# Altium project DM3390_R0M0E0.PrjPcb (part 4 of 5)

## Sheet DM3390_CAM_FFC_MIPI_2LANE.SchDoc: =project_title
size Tabloid; PageSetup: Record=PageOptions|CenterHorizontal=True|CenterVertical=True|PrintScale=0.73|XCorrection=1.00|YCorrection=1.00|PrintKind=0|BorderSize=5000000|LeftOffset=0|BottomOffset=0|Orientation=2|PaperLength=1000|PaperWidth=1000|Scale=100|PaperSource=7|PrintQuality=-4|MediaType=1|DitherType=10|PaperKind=A4|PrintScaleMode=1; CompanyName: Luxonis Holding; DrawnBy: David Malovrh; Organization: Luxonis Holding; Address1: 1925 Harmony Park Drive; Address2: Westminster, CO; Address3: 80234; Address4: United States; DocumentNumber: D0000190; SheetNumber: 4; SheetTotal: 12
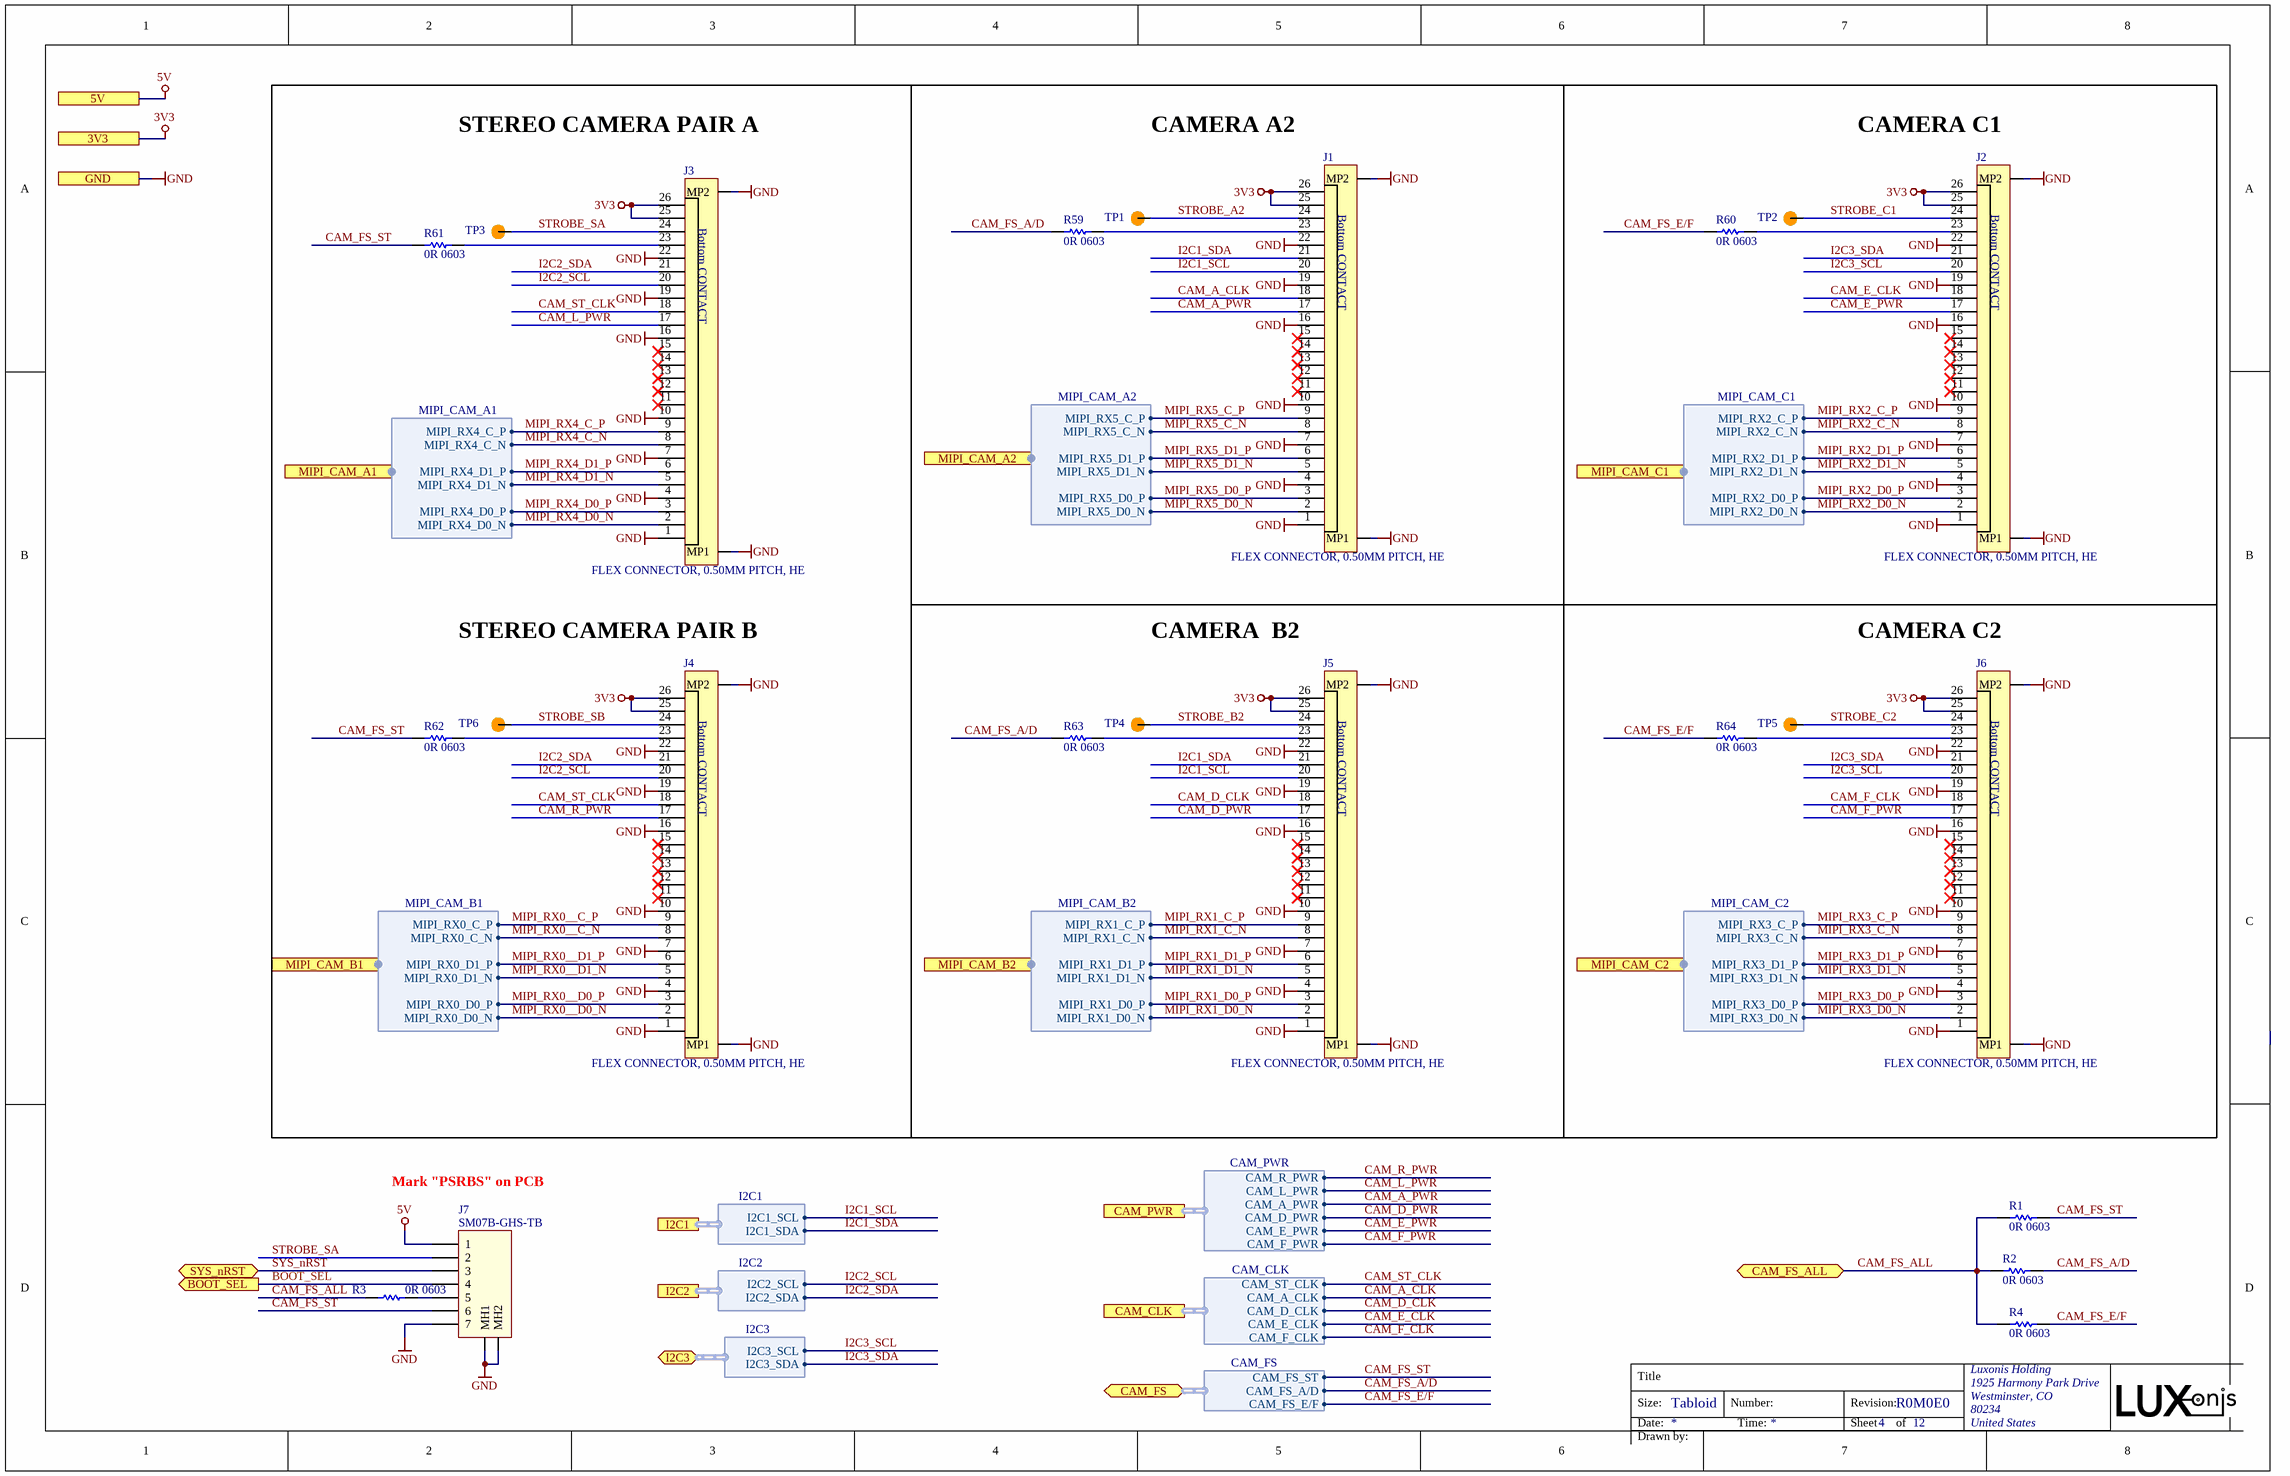
[diagram p7: DM3390_CAM_FFC_MIPI_2LANE.SchDoc]

### Parts
J1  FLEX CONNECTOR, 0.50MM PITCH, HE  [F32R-1A7H1-11026]
J2  FLEX CONNECTOR, 0.50MM PITCH, HE  [F32R-1A7H1-11026]
J3  FLEX CONNECTOR, 0.50MM PITCH, HE  [F32R-1A7H1-11026]
J4  FLEX CONNECTOR, 0.50MM PITCH, HE  [F32R-1A7H1-11026]
J5  FLEX CONNECTOR, 0.50MM PITCH, HE  [F32R-1A7H1-11026]
J6  FLEX CONNECTOR, 0.50MM PITCH, HE  [F32R-1A7H1-11026]
J7  SM07B-GHS-TB  [SM07B-GHS-TB]
R1  0R 0603  [RESC0603(1608)_N]
R2  0R 0603  [RESC0603(1608)_N]
R3  0R 0603  [RESC0603(1608)_N]
R4  0R 0603  [RESC0603(1608)_N]
R59  0R 0603  [RESC0603(1608)_N]
R60  0R 0603  [RESC0603(1608)_N]
R61  0R 0603  [RESC0603(1608)_N]
R62  0R 0603  [RESC0603(1608)_N]
R63  0R 0603  [RESC0603(1608)_N]
R64  0R 0603  [RESC0603(1608)_N]
TP1  TP100_200_NS  [TP100_200_NS]  (value not drawn)  (no BOM)
TP2  TP100_200_NS  [TP100_200_NS]  (value not drawn)  (no BOM)
TP3  TP100_200_NS  [TP100_200_NS]  (value not drawn)  (no BOM)
TP4  TP100_200_NS  [TP100_200_NS]  (value not drawn)  (no BOM)
TP5  TP100_200_NS  [TP100_200_NS]  (value not drawn)  (no BOM)
TP6  TP100_200_NS  [TP100_200_NS]  (value not drawn)  (no BOM)

### Blocks framed on the sheet
CAMERA A2: J1 R59 TP1
CAMERA C1: J2 R60 TP2
CAMERA  B2: J5 R63 TP4
CAMERA C2: J6 R64 TP5

### Ports
3V3, 5V, BOOT_SEL (out), CAM_CLK (harness CAM_CLK), CAM_FS (bidir, harness CAM_FS), CAM_FS_ALL (bidir), CAM_PWR (harness CAM_PWR), GND, I2C1 (harness I2C1), I2C2 (harness I2C2), I2C3 (bidir, harness I2C3), MIPI_CAM_A1 (harness MIPI_CAM_A1), MIPI_CAM_A2 (harness MIPI_CAM_A2), MIPI_CAM_B1 (harness MIPI_CAM_B1), MIPI_CAM_B2 (harness MIPI_CAM_B2), MIPI_CAM_C1 (harness MIPI_CAM_C1), MIPI_CAM_C2 (harness MIPI_CAM_C2), SYS_nRST (bidir)

### Harnesses
MIPI_CAM_C1: MIPI_RX2_D0_P, MIPI_RX2_D0_N, MIPI_RX2_D1_P, MIPI_RX2_D1_N, MIPI_RX2_C_P, MIPI_RX2_C_N
MIPI_CAM_C2: MIPI_RX3_C_P, MIPI_RX3_C_N, MIPI_RX3_D0_N, MIPI_RX3_D0_P, MIPI_RX3_D1_P, MIPI_RX3_D1_N
MIPI_CAM_B2: MIPI_RX1_D1_P, MIPI_RX1_D1_N, MIPI_RX1_C_P, MIPI_RX1_C_N, MIPI_RX1_D0_P, MIPI_RX1_D0_N
MIPI_CAM_B1: MIPI_RX0_D1_P, MIPI_RX0_D1_N, MIPI_RX0_C_P, MIPI_RX0_C_N, MIPI_RX0_D0_P, MIPI_RX0_D0_N
MIPI_CAM_A1: MIPI_RX4_D1_P, MIPI_RX4_D1_N, MIPI_RX4_C_P, MIPI_RX4_C_N, MIPI_RX4_D0_P, MIPI_RX4_D0_N
MIPI_CAM_A2: MIPI_RX5_D1_P, MIPI_RX5_D1_N, MIPI_RX5_C_P, MIPI_RX5_C_N, MIPI_RX5_D0_P, MIPI_RX5_D0_N
CAM_PWR: CAM_R_PWR, CAM_L_PWR, CAM_A_PWR, CAM_D_PWR, CAM_E_PWR, CAM_F_PWR
CAM_CLK: CAM_ST_CLK, CAM_A_CLK, CAM_D_CLK, CAM_E_CLK, CAM_F_CLK
CAM_FS: CAM_FS_ST, CAM_FS_A/D, CAM_FS_E/F
I2C3: I2C3_SCL, I2C3_SDA
I2C2: I2C2_SDA, I2C2_SCL
I2C1: I2C1_SDA, I2C1_SCL

### Nets
3V3: J1.25 J1.26 J2.25 J2.26 J3.25 J3.26 J4.25 J4.26 J5.25 J5.26 J6.25 J6.26 ; port 3V3
5V: J7.1 ; port 5V
GND: J1.1 J1.4 J1.7 J1.10 J1.16 J1.19 J1.22 J1.MP1 J1.MP2 J2.1 J2.4 J2.7 J2.10 J2.16 J2.19 J2.22 J2.MP1 J2.MP2 J3.1 J3.4 J3.7 J3.10 J3.16 J3.19 J3.22 J3.MP1 J3.MP2 J4.1 J4.4 J4.7 J4.10 J4.16 J4.19 J4.22 J4.MP1 J4.MP2 J5.1 J5.4 J5.7 J5.10 J5.16 J5.19 J5.22 J5.MP1 J5.MP2 J6.1 J6.4 J6.7 J6.10 J6.16 J6.19 J6.22 J6.MP1 J6.MP2 J7.7 J7.MH1 J7.MH2 ; port GND
BOOT_SEL: J7.4 ; port BOOT_SEL
CAM_A_CLK: J1.18 ; port CAM_CLK.CAM_A_CLK
CAM_A_PWR: J1.17 ; port CAM_PWR.CAM_A_PWR
CAM_D_CLK: J5.18 ; port CAM_CLK.CAM_D_CLK
CAM_D_PWR: J5.17 ; port CAM_PWR.CAM_D_PWR
CAM_E_CLK: J2.18 ; port CAM_CLK.CAM_E_CLK
CAM_E_PWR: J2.17 ; port CAM_PWR.CAM_E_PWR
CAM_F_CLK: J6.18 ; port CAM_CLK.CAM_F_CLK
CAM_F_PWR: J6.17 ; port CAM_PWR.CAM_F_PWR
CAM_FS_A/D: R2.2 R59.1 R63.1 ; port CAM_FS.CAM_FS_A/D
CAM_FS_ALL: R1.1 R2.1 R3.1 R4.1 ; port CAM_FS_ALL
CAM_FS_E/F: R4.2 R60.1 R64.1 ; port CAM_FS.CAM_FS_E/F
CAM_FS_ST: J7.6 R1.2 R61.1 R62.1 ; port CAM_FS.CAM_FS_ST
CAM_L_PWR: J3.17 ; port CAM_PWR.CAM_L_PWR
CAM_R_PWR: J4.17 ; port CAM_PWR.CAM_R_PWR
CAM_ST_CLK: J3.18 J4.18 ; port CAM_CLK.CAM_ST_CLK
I2C1_SCL: J1.20 J5.20 ; port I2C1.I2C1_SCL
I2C1_SDA: J1.21 J5.21 ; port I2C1.I2C1_SDA
I2C2_SCL: J3.20 J4.20 ; port I2C2.I2C2_SCL
I2C2_SDA: J3.21 J4.21 ; port I2C2.I2C2_SDA
I2C3_SCL: J2.20 J6.20 ; port I2C3.I2C3_SCL
I2C3_SDA: J2.21 J6.21 ; port I2C3.I2C3_SDA
MIPI_RX0__C_N: J4.8 ; port MIPI_CAM_B1.MIPI_RX0_C_N
MIPI_RX0__C_P: J4.9 ; port MIPI_CAM_B1.MIPI_RX0_C_P
MIPI_RX0__D0_N: J4.2 ; port MIPI_CAM_B1.MIPI_RX0_D0_N
MIPI_RX0__D0_P: J4.3 ; port MIPI_CAM_B1.MIPI_RX0_D0_P
MIPI_RX0__D1_N: J4.5 ; port MIPI_CAM_B1.MIPI_RX0_D1_N
MIPI_RX0__D1_P: J4.6 ; port MIPI_CAM_B1.MIPI_RX0_D1_P
MIPI_RX1_C_N: J5.8 ; port MIPI_CAM_B2.MIPI_RX1_C_N
MIPI_RX1_C_P: J5.9 ; port MIPI_CAM_B2.MIPI_RX1_C_P
MIPI_RX1_D0_N: J5.2 ; port MIPI_CAM_B2.MIPI_RX1_D0_N
MIPI_RX1_D0_P: J5.3 ; port MIPI_CAM_B2.MIPI_RX1_D0_P
MIPI_RX1_D1_N: J5.5 ; port MIPI_CAM_B2.MIPI_RX1_D1_N
MIPI_RX1_D1_P: J5.6 ; port MIPI_CAM_B2.MIPI_RX1_D1_P
MIPI_RX2_C_N: J2.8 ; port MIPI_CAM_C1.MIPI_RX2_C_N
MIPI_RX2_C_P: J2.9 ; port MIPI_CAM_C1.MIPI_RX2_C_P
MIPI_RX2_D0_N: J2.2 ; port MIPI_CAM_C1.MIPI_RX2_D0_N
MIPI_RX2_D0_P: J2.3 ; port MIPI_CAM_C1.MIPI_RX2_D0_P
MIPI_RX2_D1_N: J2.5 ; port MIPI_CAM_C1.MIPI_RX2_D1_N
MIPI_RX2_D1_P: J2.6 ; port MIPI_CAM_C1.MIPI_RX2_D1_P
MIPI_RX3_C_N: J6.8 ; port MIPI_CAM_C2.MIPI_RX3_C_N
MIPI_RX3_C_P: J6.9 ; port MIPI_CAM_C2.MIPI_RX3_C_P
MIPI_RX3_D0_N: J6.2 ; port MIPI_CAM_C2.MIPI_RX3_D0_N
MIPI_RX3_D0_P: J6.3 ; port MIPI_CAM_C2.MIPI_RX3_D0_P
MIPI_RX3_D1_N: J6.5 ; port MIPI_CAM_C2.MIPI_RX3_D1_N
MIPI_RX3_D1_P: J6.6 ; port MIPI_CAM_C2.MIPI_RX3_D1_P
MIPI_RX4_C_N: J3.8 ; port MIPI_CAM_A1.MIPI_RX4_C_N
MIPI_RX4_C_P: J3.9 ; port MIPI_CAM_A1.MIPI_RX4_C_P
MIPI_RX4_D0_N: J3.2 ; port MIPI_CAM_A1.MIPI_RX4_D0_N
MIPI_RX4_D0_P: J3.3 ; port MIPI_CAM_A1.MIPI_RX4_D0_P
MIPI_RX4_D1_N: J3.5 ; port MIPI_CAM_A1.MIPI_RX4_D1_N
MIPI_RX4_D1_P: J3.6 ; port MIPI_CAM_A1.MIPI_RX4_D1_P
MIPI_RX5_C_N: J1.8 ; port MIPI_CAM_A2.MIPI_RX5_C_N
MIPI_RX5_C_P: J1.9 ; port MIPI_CAM_A2.MIPI_RX5_C_P
MIPI_RX5_D0_N: J1.2 ; port MIPI_CAM_A2.MIPI_RX5_D0_N
MIPI_RX5_D0_P: J1.3 ; port MIPI_CAM_A2.MIPI_RX5_D0_P
MIPI_RX5_D1_N: J1.5 ; port MIPI_CAM_A2.MIPI_RX5_D1_N
MIPI_RX5_D1_P: J1.6 ; port MIPI_CAM_A2.MIPI_RX5_D1_P
STROBE_A2: J1.24 TP1.1
STROBE_B2: J5.24 TP4.1
STROBE_C1: J2.24 TP2.1
STROBE_C2: J6.24 TP5.1
STROBE_SA: J3.24 J7.2 TP3.1
STROBE_SB: J4.24 TP6.1
SYS_nRST: J7.3 ; port SYS_nRST
NetJ1_23: J1.23 R59.2
NetJ2_23: J2.23 R60.2
NetJ3_23: J3.23 R61.2
NetJ4_23: J4.23 R62.2
NetJ5_23: J5.23 R63.2
NetJ6_23: J6.23 R64.2
NetJ7_5: J7.5 R3.2

Not connected (* = marked no-connect by the designer): J1 11* 12* 13* 14* 15*; J2 11* 12* 13* 14* 15*; J3 11* 12* 13* 14* 15*; J4 11* 12* 13* 14* 15*; J5 11* 12* 13* 14* 15*; J6 11* 12* 13* 14* 15*

### Notes on the sheet
- STEREO CAMERA PAIR A
- (near J4) STEREO CAMERA PAIR B
- Mark "PSRBS" on PCB
- Title
- Size:
- Date:
- Tabloid
- Number:
- Time:
- Revision:
- Sheet
- of
- Drawn by:
- (in symbol F32R-1A7H1-11026) Bottom CONTACT

### Library data of the parts
J1-J6 = F32R-1A7H1-11026: 26 Position FFC, FPC Connector Contacts, Bottom 0.020" (0.50mm) Surface Mount, Right Angle; Manufacturer 1: Amphenol ICC (FCI); Number of Positions: 26; Voltage Rating: 50V; Current Rating: 500mA; Pitch: 0.02inch; Supplier 1: Digi-Key; Manufacturer Part Number 1: F32R-1A7H1-11026; RoHS: Yes; Category: Connectors; Pricing 1: 1=0.77, 10=0.721, 100=0.5529, 500=0.4808 (USD); Mount: Surface Mount; Contact Plating: Tin; Contact Material: Bronze; Min Operating Temperature: -40°C; Max Operating Temperature: 105°C; Packaging: Tape and Reel; Termination: Solder; Flammability Rating: UL94 V-0; ComponentLink1URL: https://cdn.amphenol-icc.com/media/wysiwyg/files/drawing/f32r-f32j.pdf; ComponentLink1Description: https://cdn.amphenol-icc.com/media/wysiwyg/files/drawing/f32r-f32j.pdf; Stock 1: 1709; Supplier Part Number 1: 609-F32R-1A7H1-11026CT-ND
J7 = SM07B-GHS-TB(LF)(SN): Conn Shrouded Header HDR 7 POS 1.25mm Solder RA Side Entry SMD T/R; Manufacturer 1: JST; Connector Type: Outer Shroud Contact; Current Rating: 1A; Voltage Rating (AC): 50V; Number of Positions: 7; Wire/Cable Gauge: 26AWG; Pitch: 0.049inch; Supplier 1: Digi-Key; Manufacturer Part Number 1: SM07B-GHS-TB(LF)(SN); RoHS: Yes; Category: Headers and Wire Housings; Stock 1: 13; Pricing 1: 1=0.55000, 10=0.51400, 100=0.39440, 500=0.34298, 1000=0.28295 (USD); Mount: Surface Mount; Color: Natural; Contact Plating: Tin; Contact Material: Bronze; Housing Material: Nylon; Housing Color: Natural; Min Operating Temperature: -25°C; Max Operating Temperature: 85°C; Number of Rows: 1; Fastening Type: Ramp; Packaging: Cut Tape; Termination: Solder; Number of Contacts: 7; REACH SVHC: Unknown; Lead Free: Lead Free; ComponentLink1URL: https://datasheet.ciiva.com/712/egh-712501.pdf?src-supplier=Digi-Key; ComponentLink1Description: https://datasheet.ciiva.com/712/egh-712501.pdf?src-supplier=Digi-Key; ComponentLink2URL: https://datasheet.ciiva.com/730/egh-730606.pdf?src-supplier=Digi-Key; ComponentLink2Description: https://datasheet.ciiva.com/730/egh-730606.pdf?src-supplier=Digi-Key; ComponentLink3URL: https://datasheet.ciiva.com/22728/5438-22728669.pdf?src-supplier=Element14; ComponentLink3Description: https://datasheet.ciiva.com/22728/5438-22728669.pdf?src-supplier=Element14
R1-R4 R59-R64 = CRCW06030000Z0EA: RES SMD 0 OHM JUMPER 1/10W 0603 0 Ohms Jumper 0.1W, 1/10W Chip Resistor 0603 (1608 Metric) Automotive AEC-Q200 Thick Film; Manufacturer 1: Vishay; Manufacturer Part Number 1: CRCW0603-0000Z0EA; Resistance: 0mR; Power Rating: 100mW; Voltage Rating: 75V; Temperature Coefficient: 100ppm/°C; Tolerance: 5%; Current Rating: 2A; Supplier 1: Digi-Key; Stock 1: 742743; Pricing 1: 1=0.100000, 10=0.034000, 25=0.024400, 50=0.018600, 100=0.013800, 250=0.010480, 500=0.008400, 1000=0.006180 (USD); RoHS: Yes; Mount: Surface Mount; Case/Package: 0603; Weight: 7.1E-05oz; Contact Plating: Tin,Lead; Case Code (Metric): 1608; Case Code (Imperial): 0603; Min Operating Temperature: -55°C; Max Operating Temperature: 155°C; Composition: Thick Film; Termination: SMD/SMT; Packaging: Tape and Reel; Package Quantity: 1; Number of Terminations: 2; Military Standard: Not; Max Power Dissipation: 100mW; Voltage Rating (DC): 75V; Features: Automotive AEC-Q200; Working Voltage: 75V; Length: 1.55mm; Height: 0.02inch; Width: 0.033inch; Depth: 0.85mm; Radiation Hardening: No; Lead Free: Lead Free; REACH SVHC: Unknown; ComponentLink1URL: https://datasheet.ciiva.com/2461/dcrcwe3-2461968.pdf?src-supplier=Digi-Key; ComponentLink1Description: https://datasheet.ciiva.com/2461/dcrcwe3-2461968.pdf?src-supplier=Digi-Key; ComponentLink2URL: https://datasheet.ciiva.com/2461/dcrcwe3-2461969.pdf?src-supplier=Digi-Key; ComponentLink2Description: https://datasheet.ciiva.com/2461/dcrcwe3-2461969.pdf?src-supplier=Digi-Key; ComponentLink3URL: https://datasheet.ciiva.com/2461/dcrcwe3-2461970.pdf?src-supplier=Digi-Key; ComponentLink3Description: https://datasheet.ciiva.com/2461/dcrcwe3-2461970.pdf?src-supplier=Digi-Key; ComponentLink4URL: https://datasheet.ciiva.com/8340/dcrcwe3-8340197.pdf?src-supplier=Avnet; ComponentLink4Description: https://datasheet.ciiva.com/8340/dcrcwe3-8340197.pdf?src-supplier=Avnet; ComponentLink5URL: https://datasheet.ciiva.com/16941/dcrcw-16941302.pdf?src-supplier=Avnet+Europe; ComponentLink5Description: https://datasheet.ciiva.com/16941/dcrcw-16941302.pdf?src-supplier=Avnet+Europe; ComponentLink6URL: https://datasheet.ciiva.com/16199/dcrcwe3-16199063.pdf?src-supplier=Future+Electronics; ComponentLink6Description: https://datasheet.ciiva.com/16199/dcrcwe3-16199063.pdf?src-supplier=Future+Electronics; ComponentLink7URL: https://datasheet.ciiva.com/16725/70201119-16725175.pdf?src-supplier=Allied+Electronics; ComponentLink7Description: https://datasheet.ciiva.com/16725/70201119-16725175.pdf?src-supplier=Allied+Electronics; ComponentLink8URL: https://datasheet.ciiva.com/26316/fld-crcw-e3-data-en-26316615.pdf?src-supplier=Distrelec; ComponentLink8Description: https://datasheet.ciiva.com/26316/fld-crcw-e3-data-en-26316615.pdf?src-supplier=Distrelec; ComponentLink9URL: https://datasheet.ciiva.com/5544/dcrcwe3-109170-5544344.pdf?src-supplier=Mouser; ComponentLink9Description: https://datasheet.ciiva.com/5544/dcrcwe3-109170-5544344.pdf?src-supplier=Mouser; ComponentLink10URL: https://datasheet.ciiva.com/7841/1720486-7841816.pdf?src-supplier=Element14; ComponentLink10Description: https://datasheet.ciiva.com/7841/1720486-7841816.pdf?src-supplier=Element14; ComponentLink11URL: https://datasheet.ciiva.com/7841/1720486-7841817.pdf?src-supplier=Element14; ComponentLink11Description: https://datasheet.ciiva.com/7841/1720486-7841817.pdf?src-supplier=Element14; ComponentLink12URL: https://datasheet.ciiva.com/7841/125364-7841818.pdf?src-supplier=Element14; ComponentLink12Description: https://datasheet.ciiva.com/7841/125364-7841818.pdf?src-supplier=Element14; ComponentLink13URL: https://datasheet.ciiva.com/16721/70201119-16721450.pdf?src-supplier=Allied+Electronics; ComponentLink13Description: https://datasheet.ciiva.com/16721/70201119-16721450.pdf?src-supplier=Allied+Electronics; Supplier Part Number 1: 541-0.0GCT-ND
TP1-TP6 = TEST_POINT

## Sheet DM3390_Connector_A.SchDoc: =project_title
size Tabloid; CompanyName: Luxonis Holding; DrawnBy: David Malovrh; Organization: Luxonis Holding; Address1: 1925 Harmony Park Drive; Address2: Westminster, CO; Address3: 80234; Address4: United States; DocumentNumber: D0000190; SheetNumber: 7; SheetTotal: 12
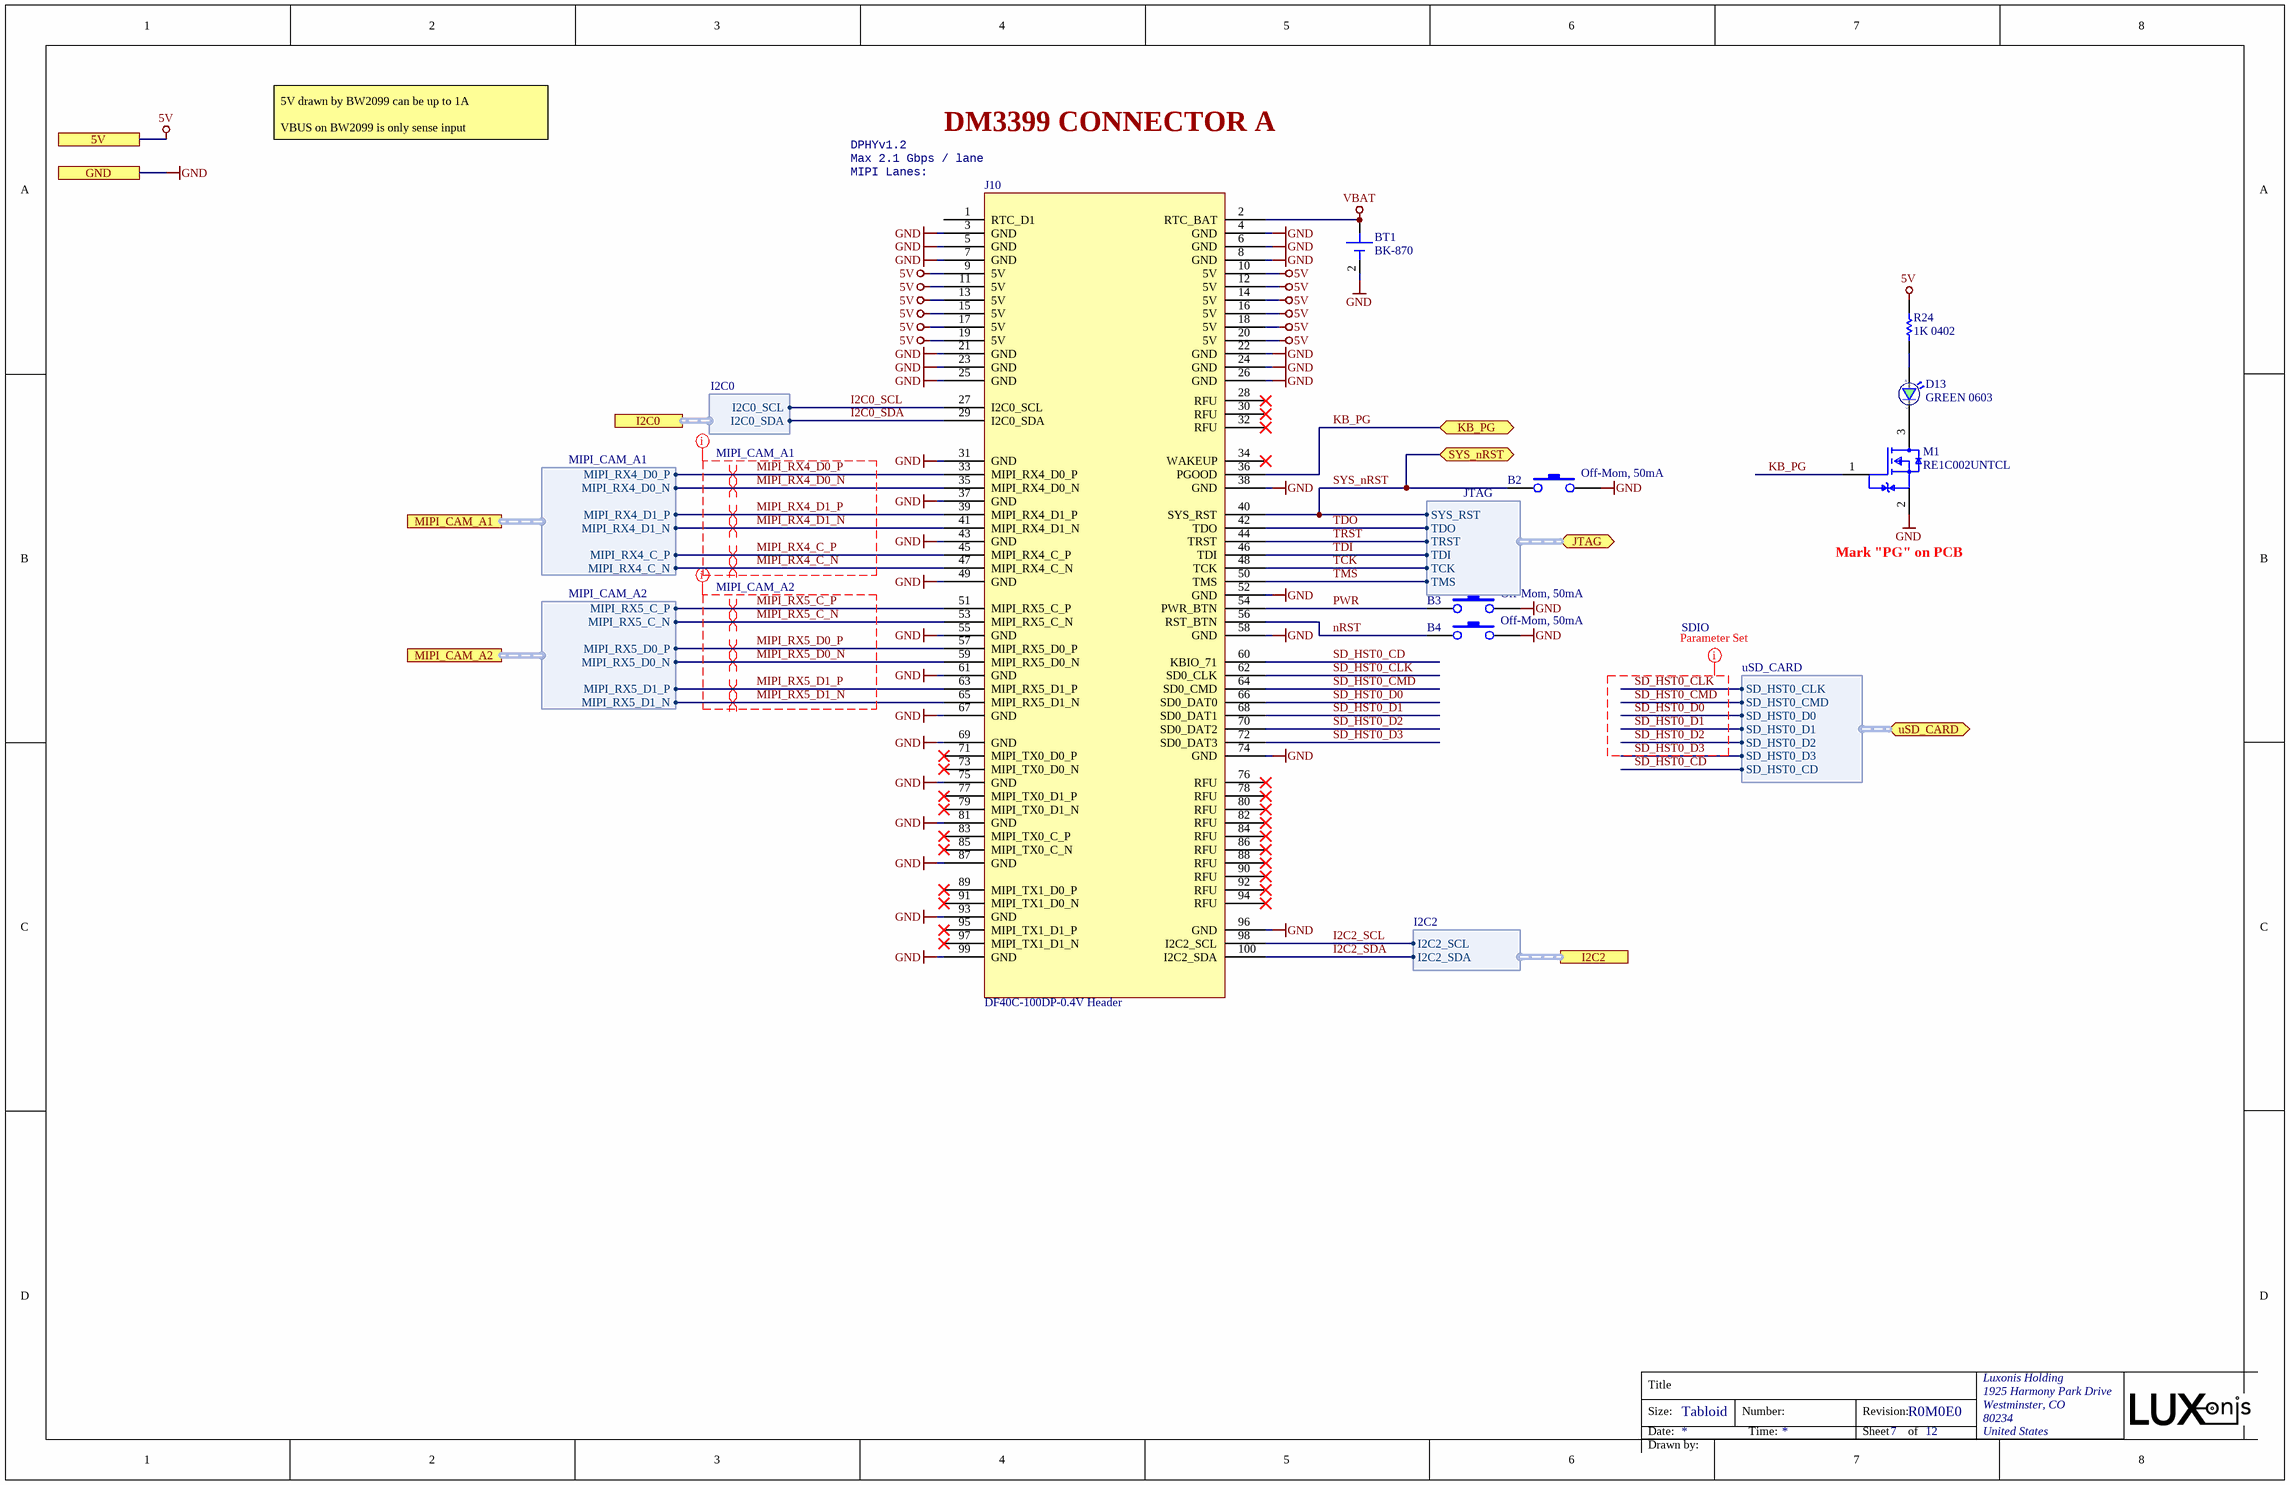
[diagram p8: DM3390_Connector_A.SchDoc]

### Parts
B2  Off-Mom, 50mA  [DTSM-32N-V]
B3  Off-Mom, 50mA  [DTSM-32N-V]
B4  Off-Mom, 50mA  [DTSM-32N-V]
BT1  BK-870  [MPD_BK-870]
D13  GREEN 0603  [SML_D1xx8W]
J10  DF40C-100DP-0.4V Header  [CON_A_SoM-MAX_DF40HC-3.0-100DS-0.4V_minpad]
M1  RE1C002UNTCL  [RE1C002UNTCL]
R24  1K 0402  [RESC0402(1005)_N]

### Ports
5V, GND, I2C0 (harness I2C0), I2C2 (harness I2C2), JTAG (bidir, harness JTAG), KB_PG (bidir), MIPI_CAM_A1 (harness MIPI_CAM_A1), MIPI_CAM_A2 (harness MIPI_CAM_A2), SYS_nRST (bidir), uSD_CARD (bidir, harness uSD_CARD)

### Harnesses
MIPI_CAM_A1: MIPI_RX4_D0_P, MIPI_RX4_D0_N, MIPI_RX4_D1_P, MIPI_RX4_D1_N, MIPI_RX4_C_P, MIPI_RX4_C_N
uSD_CARD: SD_HST0_CLK, SD_HST0_CMD, SD_HST0_D0, SD_HST0_D1, SD_HST0_D2, SD_HST0_D3, SD_HST0_CD
I2C2: I2C2_SDA, I2C2_SCL
MIPI_CAM_A2: MIPI_RX5_C_P, MIPI_RX5_C_N, MIPI_RX5_D0_P, MIPI_RX5_D0_N, MIPI_RX5_D1_P, MIPI_RX5_D1_N
I2C0: I2C0_SCL, I2C0_SDA
JTAG: SYS_RST, TDO, TRST, TDI, TCK, TMS

### Nets
5V: J10.9(5V) J10.10(5V) J10.11(5V) J10.12(5V) J10.13(5V) J10.14(5V) J10.15(5V) J10.16(5V) J10.17(5V) J10.18(5V) J10.19(5V) J10.20(5V) R24.2 ; port 5V
GND: B2.1 B3.1 B4.1 BT1.2(M) J10.3(GND) J10.4(GND) J10.5(GND) J10.6(GND) J10.7(GND) J10.8(GND) J10.21(GND) J10.22(GND) J10.23(GND) J10.24(GND) J10.25(GND) J10.26(GND) J10.31(GND) J10.37(GND) J10.38(GND) J10.43(GND) J10.49(GND) J10.52(GND) J10.55(GND) J10.58(GND) J10.61(GND) J10.67(GND) J10.69(GND) J10.74(GND) J10.75(GND) J10.81(GND) J10.87(GND) J10.93(GND) J10.96(GND) J10.99(GND) M1.2(Source) ; port GND
VBAT: BT1.1(P) BT1.3(P) J10.2(RTC_BAT)
I2C0_SCL: J10.27(I2C0_SCL) ; port I2C0.I2C0_SCL
I2C0_SDA: J10.29(I2C0_SDA) ; port I2C0.I2C0_SDA
I2C2_SCL: J10.98(I2C2_SCL) ; port I2C2.I2C2_SCL
I2C2_SDA: J10.100(I2C2_SDA) ; port I2C2.I2C2_SDA
KB_PG: J10.36(PGOOD) M1.1(Gate) ; port KB_PG
MIPI_RX4_C_N: J10.47(MIPI_RX4_C_N) ; port MIPI_CAM_A1.MIPI_RX4_C_N
MIPI_RX4_C_P: J10.45(MIPI_RX4_C_P) ; port MIPI_CAM_A1.MIPI_RX4_C_P
MIPI_RX4_D0_N: J10.35(MIPI_RX4_D0_N) ; port MIPI_CAM_A1.MIPI_RX4_D0_N
MIPI_RX4_D0_P: J10.33(MIPI_RX4_D0_P) ; port MIPI_CAM_A1.MIPI_RX4_D0_P
MIPI_RX4_D1_N: J10.41(MIPI_RX4_D1_N) ; port MIPI_CAM_A1.MIPI_RX4_D1_N
MIPI_RX4_D1_P: J10.39(MIPI_RX4_D1_P) ; port MIPI_CAM_A1.MIPI_RX4_D1_P
MIPI_RX5_C_N: J10.53(MIPI_RX5_C_N) ; port MIPI_CAM_A2.MIPI_RX5_C_N
MIPI_RX5_C_P: J10.51(MIPI_RX5_C_P) ; port MIPI_CAM_A2.MIPI_RX5_C_P
MIPI_RX5_D0_N: J10.59(MIPI_RX5_D0_N) ; port MIPI_CAM_A2.MIPI_RX5_D0_N
MIPI_RX5_D0_P: J10.57(MIPI_RX5_D0_P) ; port MIPI_CAM_A2.MIPI_RX5_D0_P
MIPI_RX5_D1_N: J10.65(MIPI_RX5_D1_N) ; port MIPI_CAM_A2.MIPI_RX5_D1_N
MIPI_RX5_D1_P: J10.63(MIPI_RX5_D1_P) ; port MIPI_CAM_A2.MIPI_RX5_D1_P
nRST: B4.2 J10.56(RST_BTN)
PWR: B3.2 J10.54(PWR_BTN)
SD_HST0_CD: J10.60(KBIO_71) ; port uSD_CARD.SD_HST0_CD
SD_HST0_CLK: J10.62(SD0_CLK) ; port uSD_CARD.SD_HST0_CLK
SD_HST0_CMD: J10.64(SD0_CMD) ; port uSD_CARD.SD_HST0_CMD
SD_HST0_D0: J10.66(SD0_DAT0) ; port uSD_CARD.SD_HST0_D0
SD_HST0_D1: J10.68(SD0_DAT1) ; port uSD_CARD.SD_HST0_D1
SD_HST0_D2: J10.70(SD0_DAT2) ; port uSD_CARD.SD_HST0_D2
SD_HST0_D3: J10.72(SD0_DAT3) ; port uSD_CARD.SD_HST0_D3
SYS_nRST: B2.2 J10.40(SYS_RST) ; port SYS_nRST, port JTAG.SYS_RST
TCK: J10.48(TCK) ; port JTAG.TCK
TDI: J10.46(TDI) ; port JTAG.TDI
TDO: J10.42(TDO) ; port JTAG.TDO
TMS: J10.50(TMS) ; port JTAG.TMS
TRST: J10.44(TRST) ; port JTAG.TRST
NetD13_1: D13.1(C) M1.3(Drain)
NetD13_2: D13.2(A) R24.1

Not connected (* = marked no-connect by the designer): J10 1(RTC_D1) 28(RFU)* 30(RFU)* 32(RFU)* 34(WAKEUP)* 71(MIPI_TX0_D0_P)* 73(MIPI_TX0_D0_N)* 76(RFU)* 77(MIPI_TX0_D1_P)* 78(RFU)* 79(MIPI_TX0_D1_N)* 80(RFU)* 82(RFU)* 83(MIPI_TX0_C_P)* 84(RFU)* 85(MIPI_TX0_C_N)* 86(RFU)* 88(RFU)* 89(MIPI_TX1_D0_P)* 90(RFU)* 91(MIPI_TX1_D0_N)* 92(RFU)* 94(RFU)* 95(MIPI_TX1_D1_P)* 97(MIPI_TX1_D1_N)*

### Layout directives
net class MIPI_CAM_A1; rule Matched Net Lengths [Delay Tolerance = 1ps]; rule Matched Net Lengths [Delay Tolerance = 0,5ps]: MIPI_RX4_C_N, MIPI_RX4_C_P, MIPI_RX4_D0_N, MIPI_RX4_D0_P, MIPI_RX4_D1_N, MIPI_RX4_D1_P
net class SDIO; rule Matched Net Lengths [Delay Tolerance = 20ps]: SD_HST0_CLK, SD_HST0_CMD, SD_HST0_D0, SD_HST0_D1, SD_HST0_D2, SD_HST0_D3
differential pair; differential pair class 100ohm: MIPI_RX4_C_N, MIPI_RX4_C_P, MIPI_RX4_D0_N, MIPI_RX4_D0_P, MIPI_RX4_D1_N, MIPI_RX4_D1_P, MIPI_RX5_C_N, MIPI_RX5_C_P, MIPI_RX5_D0_N, MIPI_RX5_D0_P, MIPI_RX5_D1_N, MIPI_RX5_D1_P
net class MIPI_CAM_A2; rule Matched Net Lengths [Delay Tolerance = 1ps]; rule Matched Net Lengths [Delay Tolerance = 0,5ps]: MIPI_RX5_C_N, MIPI_RX5_C_P, MIPI_RX5_D0_N, MIPI_RX5_D0_P, MIPI_RX5_D1_N, MIPI_RX5_D1_P

### Notes on the sheet
- 5V drawn by BW2099 can be up to 1A
  VBUS on BW2099 is only sense input
- Max 2.1 Gbps / lane
- DPHYv1.2
- DM3399 CONNECTOR A
- MIPI Lanes:
- Mark "PG" on PCB
- Title
- Size:
- Date:
- Tabloid
- Number:
- Time:
- Revision:
- Sheet
- of
- Drawn by:

### Library data of the parts
B2-B4 = DTSM-32N-V: SWITCH TACTILE SMT 3.5mm * 6mm , brown 160gf; Manufacturer 1: Diptronics; Manufacturer Part Number 1: DTSM-32N-V-T/R; Supplier 1: Mouser; Stock 1: 3199; Pricing 1: 1=0.38000, 10=0.38000, 50=0.31000, 100=0.28200, 500=0.25600, 1000=0.23600, 1600=0.20900, 4800=0.18800, 9600=0.17300, 10000=0.17300, 24000=0.16100 (USD); RoHS: No; Min Operating Temperature: -30°C; Max Operating Temperature: 80°C; Length: 6mm; Height: 5mm; Width: 3.5mm; ComponentLink1URL: https://datasheet.ciiva.com/29188/708548-da-01-en-tastschalter-smd-dtsm-32n-v-tr-1600st-29188823.pdf?src-supplier=Conrad; ComponentLink1Description: https://datasheet.ciiva.com/29188/708548-da-01-en-tastschalter-smd-dtsm-32n-v-tr-1600st-29188823.pdf?src-supplier=Conrad; Supplier Part Number 1: 113-DTSM32NVTR
BT1 = BK-870: Battery Retainer Coin 10MM SMD; Manufacturer 1: Memory Protection Devices; Number of Cells: 1; Supplier 1: Digi-Key; Manufacturer Part Number 1: BK-870; RoHS: Yes; Category: Uncategorized; Stock 1: 7093; Pricing 1: 1=0,57000, 10=0,48400, 50=0,42460, 100=0,40050, 250=0,36900, 500=0,34676, 1000=0,32451, 2500=0,29484, 5000=0,27445 (USD); Mount: Surface Mount,PCB; Termination: SMD/SMT; Package Quantity: 100; ComponentLink1URL: https://media.digikey.com/pdf/Data%20Sheets/Memory%20Protection%20PDFs/Coin_Cell_Guide.pdf?src-supplier=Digi-Key; ComponentLink1Description: https://media.digikey.com/pdf/Data%20Sheets/Memory%20Protection%20PDFs/Coin_Cell_Guide.pdf?src-supplier=Digi-Key; Supplier Part Number 1: BK-870-ND
D13 = SML-D12M8WT86: LED GREEN DIFFUSED 0603 SMD Green 572nm LED Indication - Discrete 2.2V 0603 (1608 Metric); Manufacturer: Rohm; Colour: Green,Yellow; Lens Colour: White,Clear,Diffused; Lens Style: Diffused,Colorless,Rectangular; Forward Current: 20mA; Luminous Intensity: 25mcd; Number of LEDs: 1; Viewing Angle: 160°; Lens Color: White,Diffused; Mount: Surface Mount; Case/Package: 0603; Number of Pins: 2; Case Code (Metric): 1608; Case Code (Imperial): 0603; Min Operating Temperature: -40°C; Max Operating Temperature: 85°C; Forward Voltage: 2.2V; Packaging: Tape and Reel; Dominant Wavelength: 572nm; Wavelength: 572nm; Illumination Colour: Green; Package Quantity: 1; Test Current: 20mA; Lens Transparency: Diffused; Length: 1.6mm; Height: 0.65mm; Width: 0.8mm; Radiation Hardening: No; REACH SVHC: Unknown; Lead Free: Lead Free; ComponentLink1URL: https://datasheet.ciiva.com/11774/0900766b80df3ada-11774260.pdf; ComponentLink1Description: https://datasheet.ciiva.com/11774/0900766b80df3ada-11774260.pdf; ComponentLink2URL: https://datasheet.ciiva.com/3161/sml-d1-3161419.pdf; ComponentLink2Description: https://datasheet.ciiva.com/3161/sml-d1-3161419.pdf; ComponentLink3URL: https://datasheet.ciiva.com/2110/sml-d1-2110396.pdf; ComponentLink3Description: https://datasheet.ciiva.com/2110/sml-d1-2110396.pdf; ComponentLink4URL: https://datasheet.ciiva.com/2110/sml-d1-2110397.pdf; ComponentLink4Description: https://datasheet.ciiva.com/2110/sml-d1-2110397.pdf; ComponentLink5URL: https://datasheet.ciiva.com/2110/sml-d1-2110398.pdf; ComponentLink5Description: https://datasheet.ciiva.com/2110/sml-d1-2110398.pdf; Manufacturer Part Number: SML-D12M8WT86; Supplier 1: Digi-Key; Manufacturer 1: Rohm; Manufacturer Part Number 1: SML-D12M8WT86; Stock 1: 112971; Pricing 1: 1=0.33000, 10=0.23900, 100=0.11340, 500=0.07560, 1000=0.05922 (USD); RoHS: Yes; Color: Green,Yellow; Illumination Color: Green; ComponentLink6URL: https://datasheet.ciiva.com/11774/0900766b80df3ada-11774260.pdf?src-supplier=RSComponents; ComponentLink6Description: https://datasheet.ciiva.com/11774/0900766b80df3ada-11774260.pdf?src-supplier=RSComponents; ComponentLink7URL: https://datasheet.ciiva.com/3161/sml-d1-3161419.pdf?src-supplier=Avnet; ComponentLink7Description: https://datasheet.ciiva.com/3161/sml-d1-3161419.pdf?src-supplier=Avnet; ComponentLink8URL: https://datasheet.ciiva.com/2110/sml-d1-2110396.pdf?src-supplier=Digi-Key; ComponentLink8Description: https://datasheet.ciiva.com/2110/sml-d1-2110396.pdf?src-supplier=Digi-Key; ComponentLink9URL: https://datasheet.ciiva.com/2110/sml-d1-2110397.pdf?src-supplier=Digi-Key; ComponentLink9Description: https://datasheet.ciiva.com/2110/sml-d1-2110397.pdf?src-supplier=Digi-Key; ComponentLink10URL: https://datasheet.ciiva.com/2110/sml-d1-2110398.pdf?src-supplier=Digi-Key; ComponentLink10Description: https://datasheet.ciiva.com/2110/sml-d1-2110398.pdf?src-supplier=Digi-Key; Supplier Part Number 1: 511-1578-1-ND
J10 = DF40HC(3.0)-100DS-0.4V_OAK-SoM-MAX_A: CONN HDR 100POS 0.4MM SMD GOLD BW2099 SYMBOL; Manufacturer Part Number 1: DF40C-100DP-0.4V(51); mfg: Hirose; mated_height: 1.5mm; pin_current: 0.3A; Number of Contacts: 100; Voltage Rating: 30V; Current Rating: 300mA; Connector Type: Plug; Contact Resistance: 90mR; Gender: Male; Mated Stacking Heights: 4mm; pin_pitch: 0.4mm; mating_connector: DF40C-100DP-0.4V; mfg_pn: DF40C-100DP-0.4V; Supplier 1: Digi-Key; Manufacturer 1: Hirose; Stock 1: 10165; Pricing 1: 1=1.66000, 10=1.50900, 25=1.41680, 50=1.35520, 100=1.29360, 250=1.17040, 500=1.07800, 1000=0.92400 (USD); RoHS: Yes; Mount: Surface Mount; Contact Plating: Gold; Contact Material: Bronze; Housing Color: Black; Housing Material: Polymer; Min Operating Temperature: -35°C; Max Operating Temperature: 85°C; Number of Rows: 2; Termination: SMD/SMT; Package Quantity: 1; Packaging: Tape and Reel; Number of Positions: 100; Orientation: Straight; Max Current Rating: 300mA; Max Voltage Rating (AC): 30V; Length: 21.52mm; Pitch: 0.4mm; Depth: 1.85mm; Stack Height: 1.5mm; Radiation Hardening: No; REACH SVHC: Unknown; Lead Free: Lead Free; ComponentLink1URL: https://datasheet.ciiva.com/26948/getdatasheetpartid-434445-26948932.pdf?src-supplier=Verical; ComponentLink1Description: https://datasheet.ciiva.com/26948/getdatasheetpartid-434445-26948932.pdf?src-supplier=Verical; ComponentLink2URL: https://datasheet.ciiva.com/46408/1824826-46408893.pdf?src-supplier=Element14; ComponentLink2Description: https://datasheet.ciiva.com/46408/1824826-46408893.pdf?src-supplier=Element14; ComponentLink3URL: http://datasheet.octopart.com/DF40C-100DP-0.4V%2851%29-Hirose-datasheet-12512482.pdf?src-supplier=Newark; ComponentLink3Description: http://datasheet.octopart.com/DF40C-100DP-0.4V%2851%29-Hirose-datasheet-12512482.pdf?src-supplier=Newark; ComponentLink4URL: http://datasheet.octopart.com/DF40C-100DP-0.4V%2851%29-Hirose-datasheet-24967586.pdf?src-supplier=Element14; ComponentLink4Description: http://datasheet.octopart.com/DF40C-100DP-0.4V%2851%29-Hirose-datasheet-24967586.pdf?src-supplier=Element14; ComponentLink5URL: http://datasheet.octopart.com/DF40C-100DP-0.4V%2851%29-Hirose-datasheet-8329537.pdf?src-supplier=Factory+Futures; ComponentLink5Description: http://datasheet.octopart.com/DF40C-100DP-0.4V%2851%29-Hirose-datasheet-8329537.pdf?src-supplier=Factory+Futures; ComponentLink6URL: http://datasheet.octopart.com/DF40C-100DP-0.4V%2851%29-Hirose-datasheet-62290554.pdf?src-supplier=Future+Electronics; ComponentLink6Description: http://datasheet.octopart.com/DF40C-100DP-0.4V%2851%29-Hirose-datasheet-62290554.pdf?src-supplier=Future+Electronics; ComponentLink7URL: http://datasheet.octopart.com/DF40C-100DP-0.4V%2851%29-Hirose-datasheet-130255728.pdf?src-supplier=Future+Electronics; ComponentLink7Description: http://datasheet.octopart.com/DF40C-100DP-0.4V%2851%29-Hirose-datasheet-130255728.pdf?src-supplier=Future+Electronics; Supplier Part Number 1: H11614CT-ND; Supplier 2: Mouser; Supplier Part Number 2: 798-DF40C100DP0.4V51
M1 = RE1C002UNTCL: MOSFET N-CH 20V 0.2A EMT3; Manufacturer 1: Rohm; Continuous Drain Current (ID): 200mA; Rds On Max: 1.2R; Input Capacitance: 25pF; Max Power Dissipation: 150mW; RoHS: Yes; Mount: Surface Mount; Case/Package: SOT-89; Packaging: Tape and Reel; Drain to Source Voltage (Vdss): 20V; Lead Free: Lead Free; ComponentLink1URL: http://www.mouser.com/ds/2/348/re1c002untcl-e-1018231.pdf?src-supplier=Mouser; ComponentLink1Description: http://www.mouser.com/ds/2/348/re1c002untcl-e-1018231.pdf?src-supplier=Mouser; ComponentLink2URL: http://rohmfs.rohm.com/en/techdata_basic/transistor/taping/EMT3_TL_taping.pdf?src-supplier=Digi-Key; ComponentLink2Description: http://rohmfs.rohm.com/en/techdata_basic/transistor/taping/EMT3_TL_taping.pdf?src-supplier=Digi-Key; ComponentLink3URL: http://rohmfs.rohm.com/en/products/databook/datasheet/discrete/transistor/mosfet/re1c002un.pdf?src-supplier=Avnet; ComponentLink3Description: http://rohmfs.rohm.com/en/products/databook/datasheet/discrete/transistor/mosfet/re1c002un.pdf?src-supplier=Avnet; ComponentLink4URL: https://www.rohm.com/datasheet/RE1C002UN/re1c002untcl-e?src-supplier=Digi-Key; ComponentLink4Description: https://www.rohm.com/datasheet/RE1C002UN/re1c002untcl-e?src-supplier=Digi-Key; ComponentLink5URL: http://www.farnell.com/datasheets/2704376.pdf?src-supplier=Newark; ComponentLink5Description: http://www.farnell.com/datasheets/2704376.pdf?src-supplier=Newark; ComponentLink6URL: http://www.farnell.com/datasheets/2704376.pdf?src-supplier=Farnell; ComponentLink6Description: http://www.farnell.com/datasheets/2704376.pdf?src-supplier=Farnell; ComponentLink7URL: http://www.farnell.com/datasheets/2704376.pdf?src-supplier=Element14; ComponentLink7Description: http://www.farnell.com/datasheets/2704376.pdf?src-supplier=Element14; Supplier 1: Digi-Key; Manufacturer Part Number 1: RE1C002UNTCL; Stock 1: 868886; Pricing 1: 1=0.20000, 10=0.18200, 100=0.09930, 500=0.06112, 1000=0.04167 (USD); Supplier Part Number 1: RE1C002UNTCLCT-ND
R24 = RC0402FR-071KL: RES SMD 1K OHM 1% 1/16W 0402 1 kOhms ±1% 0.063W, 1/16W Chip Resistor 0402 (1005 Metric) Moisture Resistant Thick Film; Manufacturer 1: Yageo; Temperature Coefficient: 100ppm/°C; Power Rating: 62.5mW; Voltage Rating (DC): 50V; Resistance: 1kR; RoHS: Yes; Number of Pins: 2; Case Code (Imperial): 0402; Case Code (Metric): 1005; Min Operating Temperature: -55°C; Max Operating Temperature: 155°C; Packaging: Tape and Reel; Composition: Thick Film; Voltage Rating: 50V; Military Standard: Not; Termination: SMD/SMT; Length: 1mm; Height: 0.32mm; Width: 0.5mm; Depth: 0.5mm; Lead Free: Lead Free; REACH SVHC: Unknown; ComponentLink1URL: https://datasheet.ciiva.com/11819/0900766b80c66297-11819477.pdf?src-supplier=RSComponents; ComponentLink1Description: https://datasheet.ciiva.com/11819/0900766b80c66297-11819477.pdf?src-supplier=RSComponents; ComponentLink2URL: https://datasheet.ciiva.com/12666/pyu-rc0402-51-rohs-l-6-r-12666741.pdf?src-supplier=Mouser; ComponentLink2Description: https://datasheet.ciiva.com/12666/pyu-rc0402-51-rohs-l-6-r-12666741.pdf?src-supplier=Mouser; ComponentLink3URL: https://datasheet.ciiva.com/17063/pyu-rc0402-51-rohs-l-6-r-17063193.pdf?src-supplier=Future+Electronics; ComponentLink3Description: https://datasheet.ciiva.com/17063/pyu-rc0402-51-rohs-l-6-r-17063193.pdf?src-supplier=Future+Electronics; ComponentLink4URL: https://datasheet.ciiva.com/22747/1018594-22747513.pdf?src-supplier=Element14; ComponentLink4Description: https://datasheet.ciiva.com/22747/1018594-22747513.pdf?src-supplier=Element14; ComponentLink5URL: https://datasheet.ciiva.com/7849/1018594-7849869.pdf?src-supplier=Element14; ComponentLink5Description: https://datasheet.ciiva.com/7849/1018594-7849869.pdf?src-supplier=Element14; ComponentLink6URL: https://datasheet.ciiva.com/7983/1018594-7983502.pdf?src-supplier=Element14; ComponentLink6Description: https://datasheet.ciiva.com/7983/1018594-7983502.pdf?src-supplier=Element14; ComponentLink7URL: https://datasheet.ciiva.com/7849/1018594-7849871.pdf?src-supplier=Element14; ComponentLink7Description: https://datasheet.ciiva.com/7849/1018594-7849871.pdf?src-supplier=Element14; Supplier 1: Digi-Key; Manufacturer Part Number 1: RC0402FR-071KL; Stock 1: 60695854; Pricing 1: 1=0.10000, 10=0.01600, 100=0.00670, 1000=0.00301, 2500=0.00261, 5000=0.00215 (USD); Case/Package: 0402; Tolerance: 1%; Supplier Part Number 1: 311-1.00KLRCT-ND

## Sheet DM3390_Connector_B.SchDoc: =project_title
size Tabloid; CompanyName: Luxonis Holding; DrawnBy: David Malovrh; Organization: Luxonis Holding; Address1: 1925 Harmony Park Drive; Address2: Westminster, CO; Address3: 80234; Address4: United States; DocumentNumber: D0000190; SheetNumber: 8; SheetTotal: 12
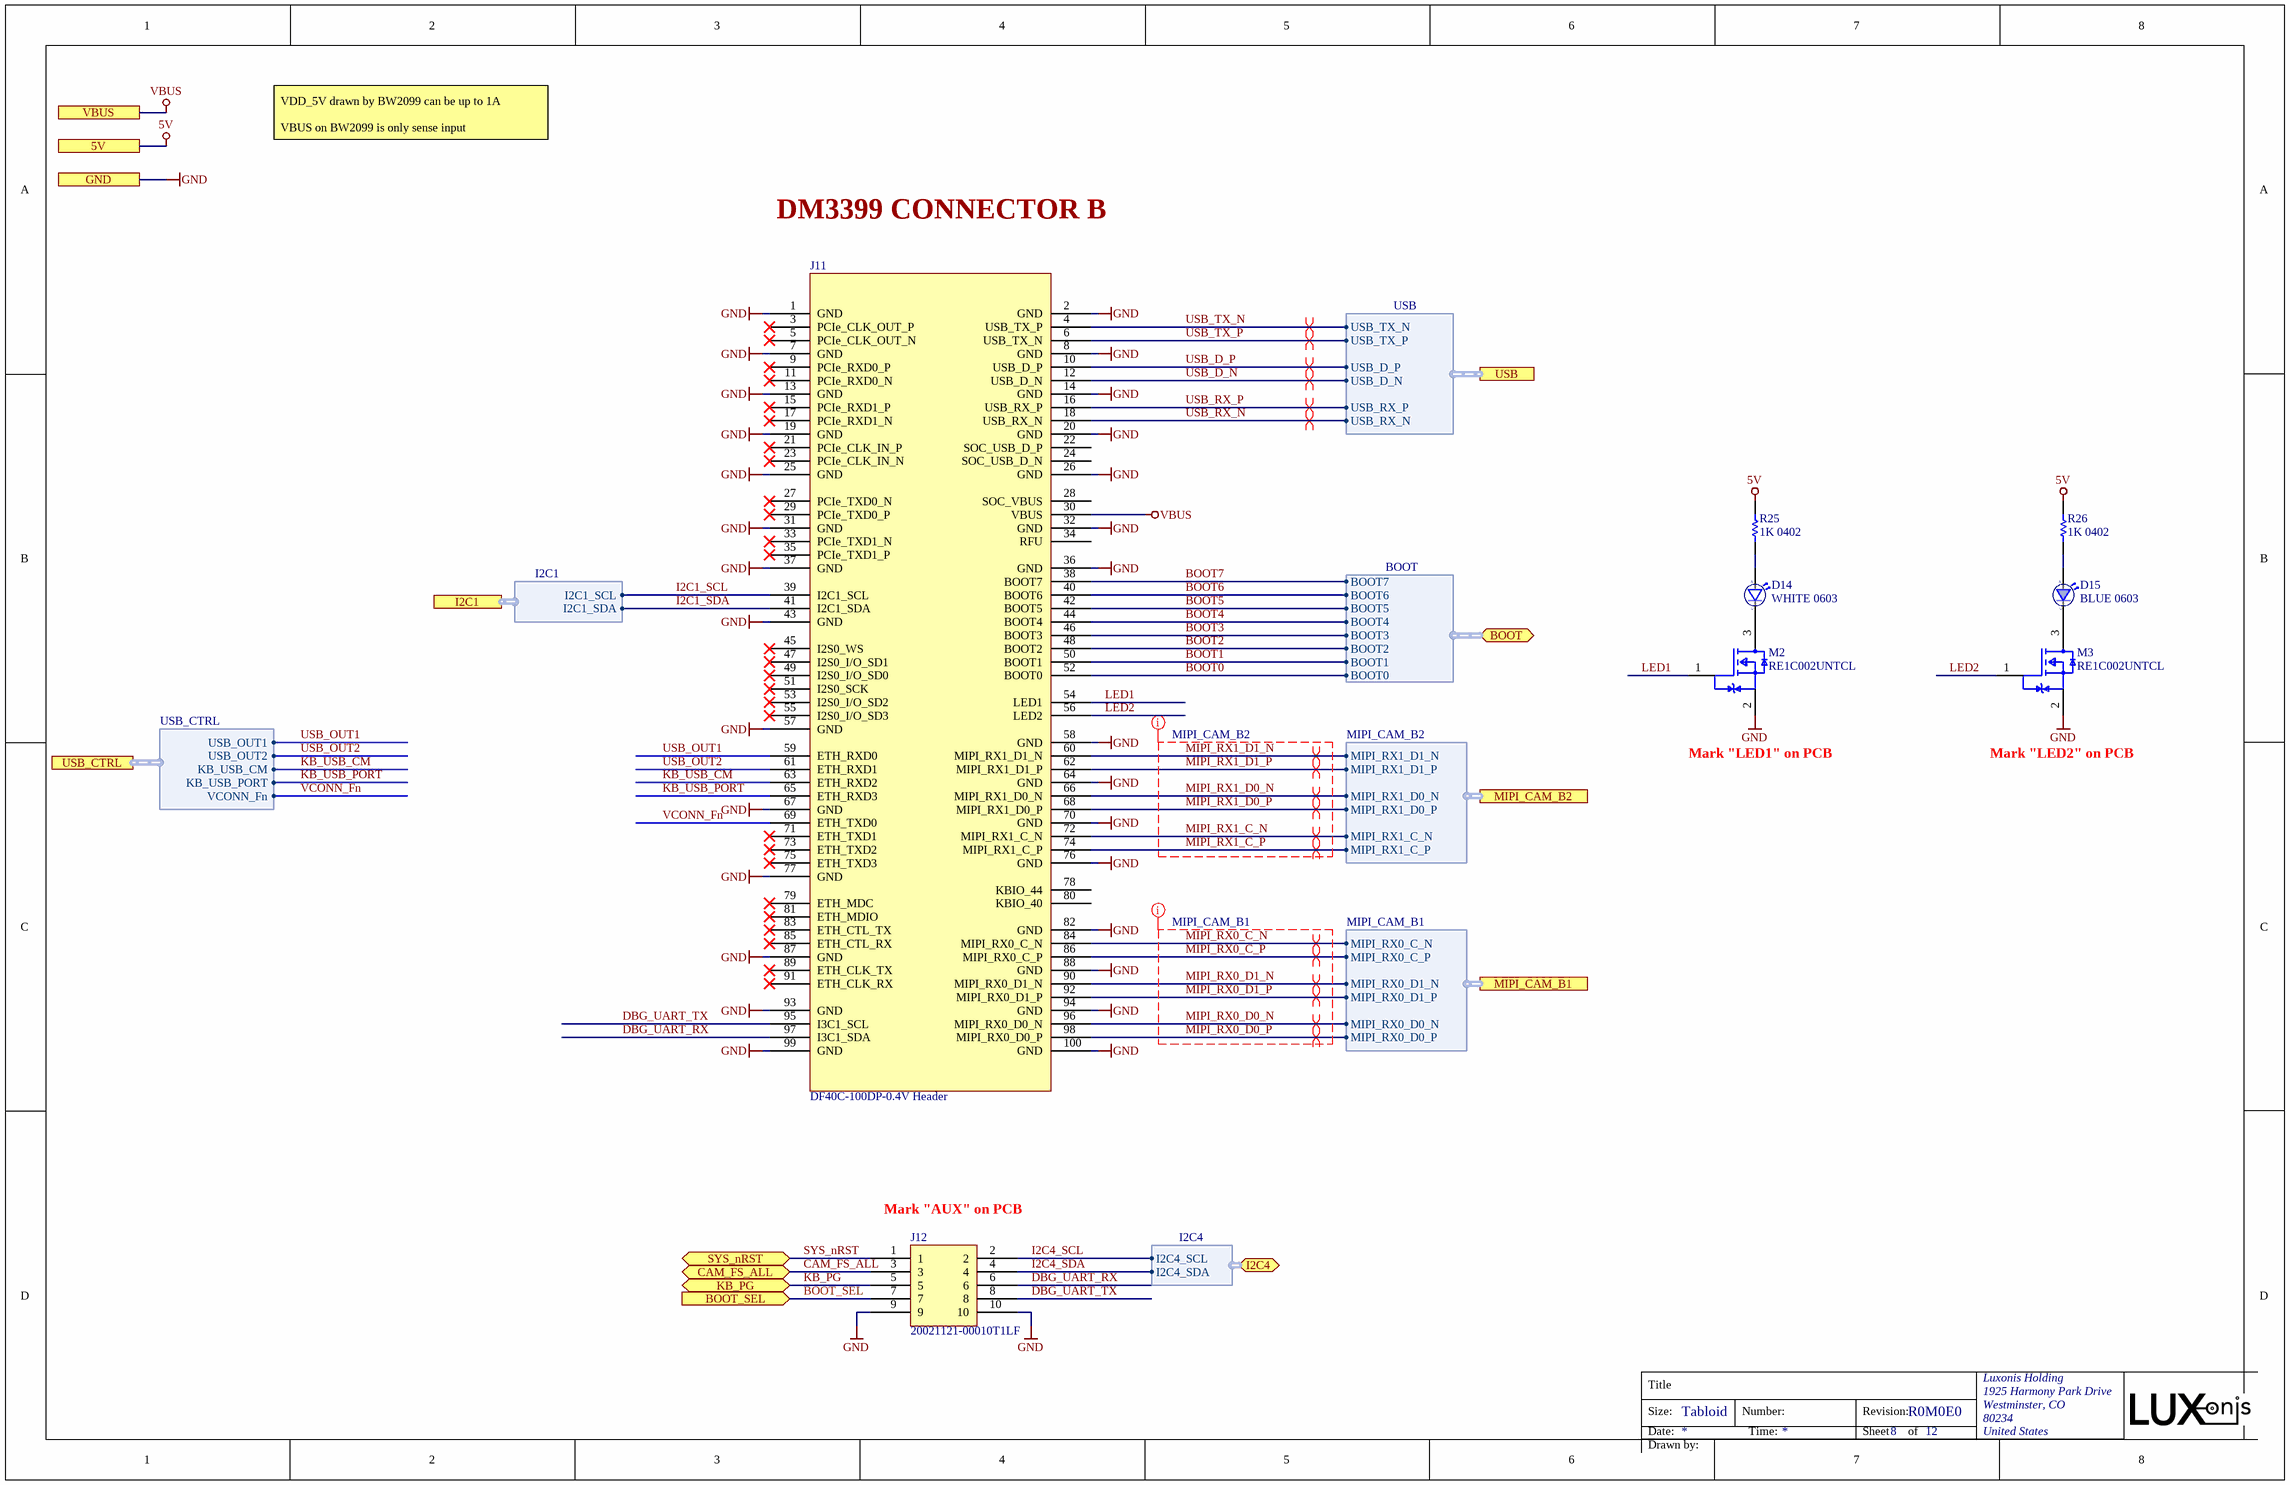
[diagram p9: DM3390_Connector_B.SchDoc]

### Parts
D14  WHITE 0603  [SML_D1xx8W]
D15  BLUE 0603  [SML_D1xx8W]
J11  DF40C-100DP-0.4V Header  [CON_B_SoM-MAX_DF40HC-3.0-100DS-0.4V_minpad]
J12  20021121-00010T1LF  [20021121-00010T1LF]
M2  RE1C002UNTCL  [RE1C002UNTCL]
M3  RE1C002UNTCL  [RE1C002UNTCL]
R25  1K 0402  [RESC0402(1005)_N]
R26  1K 0402  [RESC0402(1005)_N]

### Ports
5V, BOOT (bidir, harness BOOT), BOOT_SEL (in), CAM_FS_ALL (bidir), GND, I2C1 (harness I2C1), I2C4 (bidir, harness I2C4), KB_PG (bidir), MIPI_CAM_B1 (harness MIPI_CAM_B1), MIPI_CAM_B2 (harness MIPI_CAM_B2), SYS_nRST (bidir), USB (harness USB), USB_CTRL (harness USB_CTRL), VBUS

### Harnesses
USB: USB_D_P, USB_D_N, USB_TX_N, USB_TX_P, USB_RX_P, USB_RX_N
BOOT: BOOT4, BOOT3, BOOT2, BOOT1, BOOT0, BOOT5, BOOT6, BOOT7
MIPI_CAM_B2: MIPI_RX1_D1_N, MIPI_RX1_D1_P, MIPI_RX1_D0_N, MIPI_RX1_D0_P, MIPI_RX1_C_N, MIPI_RX1_C_P
MIPI_CAM_B1: MIPI_RX0_D1_N, MIPI_RX0_D1_P, MIPI_RX0_C_N, MIPI_RX0_C_P, MIPI_RX0_D0_N, MIPI_RX0_D0_P
I2C1: I2C1_SDA, I2C1_SCL
I2C4: I2C4_SCL, I2C4_SDA
USB_CTRL: USB_OUT1, USB_OUT2, KB_USB_CM, KB_USB_PORT, VCONN_Fn

### Nets
5V: R25.2 R26.2 ; port 5V
GND: J11.1(GND) J11.2(GND) J11.7(GND) J11.8(GND) J11.13(GND) J11.14(GND) J11.19(GND) J11.20(GND) J11.25(GND) J11.26(GND) J11.31(GND) J11.32(GND) J11.36(GND) J11.37(GND) J11.43(GND) J11.57(GND) J11.58(GND) J11.64(GND) J11.67(GND) J11.70(GND) J11.76(GND) J11.77(GND) J11.82(GND) J11.87(GND) J11.88(GND) J11.93(GND) J11.94(GND) J11.99(GND) J11.100(GND) J12.9 J12.10 M2.2(Source) M3.2(Source) ; port GND
VBUS: J11.30(VBUS) ; port VBUS
BOOT0: J11.52(BOOT0) ; port BOOT.BOOT0
BOOT1: J11.50(BOOT1) ; port BOOT.BOOT1
BOOT2: J11.48(BOOT2) ; port BOOT.BOOT2
BOOT3: J11.46(BOOT3) ; port BOOT.BOOT3
BOOT4: J11.44(BOOT4) ; port BOOT.BOOT4
BOOT5: J11.42(BOOT5) ; port BOOT.BOOT5
BOOT6: J11.40(BOOT6) ; port BOOT.BOOT6
BOOT7: J11.38(BOOT7) ; port BOOT.BOOT7
BOOT_SEL: J12.7 ; port BOOT_SEL
CAM_FS_ALL: J12.3 ; port CAM_FS_ALL
DBG_UART_RX: J11.97(I3C1_SDA) J12.6
DBG_UART_TX: J11.95(I3C1_SCL) J12.8
I2C1_SCL: J11.39(I2C1_SCL) ; port I2C1.I2C1_SCL
I2C1_SDA: J11.41(I2C1_SDA) ; port I2C1.I2C1_SDA
I2C4_SCL: J12.2 ; port I2C4.I2C4_SCL
I2C4_SDA: J12.4 ; port I2C4.I2C4_SDA
KB_PG: J12.5 ; port KB_PG
KB_USB_CM: J11.63(ETH_RXD2) ; port USB_CTRL.KB_USB_CM
KB_USB_PORT: J11.65(ETH_RXD3) ; port USB_CTRL.KB_USB_PORT
LED1: J11.54(LED1) M2.1(Gate)
LED2: J11.56(LED2) M3.1(Gate)
MIPI_RX0_C_N: J11.84(MIPI_RX0_C_N) ; port MIPI_CAM_B1.MIPI_RX0_C_N  [project net MIPI_RX0__C_N]
MIPI_RX0_C_P: J11.86(MIPI_RX0_C_P) ; port MIPI_CAM_B1.MIPI_RX0_C_P  [project net MIPI_RX0__C_P]
MIPI_RX0_D0_N: J11.96(MIPI_RX0_D0_N) ; port MIPI_CAM_B1.MIPI_RX0_D0_N  [project net MIPI_RX0__D0_N]
MIPI_RX0_D0_P: J11.98(MIPI_RX0_D0_P) ; port MIPI_CAM_B1.MIPI_RX0_D0_P  [project net MIPI_RX0__D0_P]
MIPI_RX0_D1_N: J11.90(MIPI_RX0_D1_N) ; port MIPI_CAM_B1.MIPI_RX0_D1_N  [project net MIPI_RX0__D1_N]
MIPI_RX0_D1_P: J11.92(MIPI_RX0_D1_P) ; port MIPI_CAM_B1.MIPI_RX0_D1_P  [project net MIPI_RX0__D1_P]
MIPI_RX1_C_N: J11.72(MIPI_RX1_C_N) ; port MIPI_CAM_B2.MIPI_RX1_C_N
MIPI_RX1_C_P: J11.74(MIPI_RX1_C_P) ; port MIPI_CAM_B2.MIPI_RX1_C_P
MIPI_RX1_D0_N: J11.66(MIPI_RX1_D0_N) ; port MIPI_CAM_B2.MIPI_RX1_D0_N
MIPI_RX1_D0_P: J11.68(MIPI_RX1_D0_P) ; port MIPI_CAM_B2.MIPI_RX1_D0_P
MIPI_RX1_D1_N: J11.60(MIPI_RX1_D1_N) ; port MIPI_CAM_B2.MIPI_RX1_D1_N
MIPI_RX1_D1_P: J11.62(MIPI_RX1_D1_P) ; port MIPI_CAM_B2.MIPI_RX1_D1_P
SYS_nRST: J12.1 ; port SYS_nRST
USB_D_N: J11.12(USB_D_N) ; port USB.USB_D_N
USB_D_P: J11.10(USB_D_P) ; port USB.USB_D_P
USB_OUT1: J11.59(ETH_RXD0) ; port USB_CTRL.USB_OUT1
USB_OUT2: J11.61(ETH_RXD1) ; port USB_CTRL.USB_OUT2
USB_RX_N: J11.18(USB_RX_N) ; port USB.USB_RX_N
USB_RX_P: J11.16(USB_RX_P) ; port USB.USB_RX_P
USB_TX_N: J11.4(USB_TX_P) ; port USB.USB_TX_N
USB_TX_P: J11.6(USB_TX_N) ; port USB.USB_TX_P
VCONN_Fn: J11.69(ETH_TXD0) ; port USB_CTRL.VCONN_Fn
NetD14_1: D14.1(C) M2.3(Drain)
NetD14_2: D14.2(A) R25.1
NetD15_1: D15.1(C) M3.3(Drain)
NetD15_2: D15.2(A) R26.1

Not connected (* = marked no-connect by the designer): J11 3(PCIe_CLK_OUT_P)* 5(PCIe_CLK_OUT_N)* 9(PCIe_RXD0_P)* 11(PCIe_RXD0_N)* 15(PCIe_RXD1_P)* 17(PCIe_RXD1_N)* 21(PCIe_CLK_IN_P)* 22(SOC_USB_D_P) 23(PCIe_CLK_IN_N)* 24(SOC_USB_D_N) 27(PCIe_TXD0_N)* 28(SOC_VBUS) 29(PCIe_TXD0_P)* 33(PCIe_TXD1_N)* 34(RFU) 35(PCIe_TXD1_P)* 45(I2S0_WS)* 47(I2S0_I/O_SD1)* 49(I2S0_I/O_SD0)* 51(I2S0_SCK)* 53(I2S0_I/O_SD2)* 55(I2S0_I/O_SD3)* 71(ETH_TXD1)* 73(ETH_TXD2)* 75(ETH_TXD3)* 78(KBIO_44) 79(ETH_MDC)* 80(KBIO_40) 81(ETH_MDIO)* 83(ETH_CTL_TX)* 85(ETH_CTL_RX)* 89(ETH_CLK_TX)* 91(ETH_CLK_RX)*

### Layout directives
differential pair; differential pair class 90ohm: USB_D_N, USB_D_P, USB_RX_N, USB_RX_P, USB_TX_N, USB_TX_P
differential pair; differential pair class 100ohm: MIPI_RX0__C_N, MIPI_RX0__C_P, MIPI_RX0__D0_N, MIPI_RX0__D0_P, MIPI_RX0__D1_N, MIPI_RX0__D1_P, MIPI_RX1_C_N, MIPI_RX1_C_P, MIPI_RX1_D0_N, MIPI_RX1_D0_P, MIPI_RX1_D1_N, MIPI_RX1_D1_P
net class MIPI_CAM_B2; rule Matched Net Lengths [Delay Tolerance = 1ps]; rule Matched Net Lengths [Delay Tolerance = 0,5ps]: MIPI_RX1_C_N, MIPI_RX1_C_P, MIPI_RX1_D0_N, MIPI_RX1_D0_P, MIPI_RX1_D1_N, MIPI_RX1_D1_P
net class MIPI_CAM_B1; rule Matched Net Lengths [Delay Tolerance = 1ps]; rule Matched Net Lengths [Delay Tolerance = 0,5ps]: MIPI_RX0_C_N, MIPI_RX0_C_P, MIPI_RX0_D0_N, MIPI_RX0_D0_P, MIPI_RX0_D1_N, MIPI_RX0_D1_P

### Notes on the sheet
- VDD_5V drawn by BW2099 can be up to 1A
  VBUS on BW2099 is only sense input
- DM3399 CONNECTOR B
- Mark "LED1" on PCB
- Mark "LED2" on PCB
- (near J12) Mark "AUX" on PCB
- Title
- Size:
- Date:
- Tabloid
- Number:
- Time:
- Revision:
- Sheet
- of
- Drawn by:

### Library data of the parts
D14 = SML-D12WBN1W1: LED Uni-Color White 2-Pin Chip 0603(1608Metric) T/R; Manufacturer 1: Rohm; Manufacturer Part Number 1: SMLD12WBN1W1; Supplier 1: RSComponents; RoHS: Yes; Category: LEDs; Stock 1: 1; Pricing 1: 30=0,53800, 150=0,45300, 300=0,40900 (USD); RoHS Compliant: Yes; ComponentLink1URL: https://www.rohm.com/datasheet/SMLD12WBN1W/smld12-e?src-supplier=Digi-Key; ComponentLink1Description: https://www.rohm.com/datasheet/SMLD12WBN1W/smld12-e?src-supplier=Digi-Key; Supplier Part Number 1: 1826302
D15 = SML-D12BN1WT86: LED Uni-Color Blue 2-Pin Chip 0603(1608Metric) T/R; Manufacturer 1: Rohm; Manufacturer Part Number 1: SMLD12BN1WT86; Supplier 1: Newark; RoHS: Yes; Category: LEDs; Stock 1: 2992; Pricing 1: 1=1,01000, 10=0,66800, 25=0,59200, 50=0,51800, 100=0,44200 (USD); RoHS Compliant: Yes; ComponentLink1URL: http://www.farnell.com/datasheets/2711924.pdf?src-supplier=Newark; ComponentLink1Description: http://www.farnell.com/datasheets/2711924.pdf?src-supplier=Newark; Supplier Part Number 1: 84AC7329
J11 = DF40HC(3.0)-100DS-0.4V_OAK-SoM-MAX_B: CONN HDR 100POS 0.4MM SMD GOLD BW2099 SYMBOL; Manufacturer Part Number 1: DF40C-100DP-0.4V(51); mfg: Hirose; mated_height: 1.5mm; pin_current: 0.3A; Number of Contacts: 100; Voltage Rating: 30V; Current Rating: 300mA; Connector Type: Plug; Contact Resistance: 90mR; Gender: Male; Mated Stacking Heights: 4mm; pin_pitch: 0.4mm; mating_connector: DF40C-100DP-0.4V; mfg_pn: DF40C-100DP-0.4V; Supplier 1: Digi-Key; Manufacturer 1: Hirose; Stock 1: 10165; Pricing 1: 1=1.66000, 10=1.50900, 25=1.41680, 50=1.35520, 100=1.29360, 250=1.17040, 500=1.07800, 1000=0.92400 (USD); RoHS: Yes; Mount: Surface Mount; Contact Plating: Gold; Contact Material: Bronze; Housing Color: Black; Housing Material: Polymer; Min Operating Temperature: -35°C; Max Operating Temperature: 85°C; Number of Rows: 2; Termination: SMD/SMT; Package Quantity: 1; Packaging: Tape and Reel; Number of Positions: 100; Orientation: Straight; Max Current Rating: 300mA; Max Voltage Rating (AC): 30V; Length: 21.52mm; Pitch: 0.4mm; Depth: 1.85mm; Stack Height: 1.5mm; Radiation Hardening: No; REACH SVHC: Unknown; Lead Free: Lead Free; ComponentLink1URL: https://datasheet.ciiva.com/26948/getdatasheetpartid-434445-26948932.pdf?src-supplier=Verical; ComponentLink1Description: https://datasheet.ciiva.com/26948/getdatasheetpartid-434445-26948932.pdf?src-supplier=Verical; ComponentLink2URL: https://datasheet.ciiva.com/46408/1824826-46408893.pdf?src-supplier=Element14; ComponentLink2Description: https://datasheet.ciiva.com/46408/1824826-46408893.pdf?src-supplier=Element14; ComponentLink3URL: http://datasheet.octopart.com/DF40C-100DP-0.4V%2851%29-Hirose-datasheet-12512482.pdf?src-supplier=Newark; ComponentLink3Description: http://datasheet.octopart.com/DF40C-100DP-0.4V%2851%29-Hirose-datasheet-12512482.pdf?src-supplier=Newark; ComponentLink4URL: http://datasheet.octopart.com/DF40C-100DP-0.4V%2851%29-Hirose-datasheet-24967586.pdf?src-supplier=Element14; ComponentLink4Description: http://datasheet.octopart.com/DF40C-100DP-0.4V%2851%29-Hirose-datasheet-24967586.pdf?src-supplier=Element14; ComponentLink5URL: http://datasheet.octopart.com/DF40C-100DP-0.4V%2851%29-Hirose-datasheet-8329537.pdf?src-supplier=Factory+Futures; ComponentLink5Description: http://datasheet.octopart.com/DF40C-100DP-0.4V%2851%29-Hirose-datasheet-8329537.pdf?src-supplier=Factory+Futures; ComponentLink6URL: http://datasheet.octopart.com/DF40C-100DP-0.4V%2851%29-Hirose-datasheet-62290554.pdf?src-supplier=Future+Electronics; ComponentLink6Description: http://datasheet.octopart.com/DF40C-100DP-0.4V%2851%29-Hirose-datasheet-62290554.pdf?src-supplier=Future+Electronics; ComponentLink7URL: http://datasheet.octopart.com/DF40C-100DP-0.4V%2851%29-Hirose-datasheet-130255728.pdf?src-supplier=Future+Electronics; ComponentLink7Description: http://datasheet.octopart.com/DF40C-100DP-0.4V%2851%29-Hirose-datasheet-130255728.pdf?src-supplier=Future+Electronics; Supplier Part Number 1: H11614CT-ND; Supplier 2: Mouser; Supplier Part Number 2: 798-DF40C100DP0.4V51
J12 = 20021121-00010T1LF: CONN HEADER SMD 10POS 1.27MM; Manufacturer 1: Amphenol FCI; Number of Contacts: 10; Contact Resistance: 30mR; Max Voltage Rating (AC): 125V; Connector Type: Male Pin; Row Spacing: 0.05inch; Supplier 1: Digi-Key; Manufacturer Part Number 1: 20021121-00010T1LF; Stock 1: 1465; Pricing 1: 1=0.77000, 10=0.71800, 100=0.55040, 500=0.47860, 1000=0.39485, 5000=0.34699, 10000=0.32306 (USD); RoHS: Yes; Mount: Surface Mount; Contact Plating: Gold; Color: Black; Contact Material: Copper Alloy; Housing Color: Black; Housing Material: Thermoplastic; Min Operating Temperature: -40°C; Max Operating Temperature: 85°C; Number of Rows: 2; Termination: Solder; Package Quantity: 93; Packaging: Rail/Tube; Number of Positions: 10; Orientation: Straight; Length: 6.35mm; Pitch: 1.27mm; Contact Mating Length: 0.12inch; Depth: 3.4mm; ComponentLink1URL: https://datasheet.ciiva.com/18659/20021121-18659066.pdf?src-supplier=Digi-Key; ComponentLink1Description: https://datasheet.ciiva.com/18659/20021121-18659066.pdf?src-supplier=Digi-Key; ComponentLink2URL: https://datasheet.ciiva.com/10033/20021121-10033582.pdf?src-supplier=Avnet; ComponentLink2Description: https://datasheet.ciiva.com/10033/20021121-10033582.pdf?src-supplier=Avnet; Supplier Part Number 1: 609-6529-ND; Supplier 2: Mouser; Supplier 3: TTI; Supplier Part Number 2: 649-200211210010T1LF; Supplier Part Number 3: 20021121-00010T1LF
M2 M3 = RE1C002UNTCL: as M1 on sheet DM3390_Connector_A; RoHS: Yes; Mount: Surface Mount; Case/Package: SOT-89; Packaging: Tape and Reel; Drain to Source Voltage (Vdss): 20V; Lead Free: Lead Free; ComponentLink1URL: http://www.mouser.com/ds/2/348/re1c002untcl-e-1018231.pdf?src-supplier=Mouser; ComponentLink1Description: http://www.mouser.com/ds/2/348/re1c002untcl-e-1018231.pdf?src-supplier=Mouser; ComponentLink2URL: http://rohmfs.rohm.com/en/techdata_basic/transistor/taping/EMT3_TL_taping.pdf?src-supplier=Digi-Key; ComponentLink2Description: http://rohmfs.rohm.com/en/techdata_basic/transistor/taping/EMT3_TL_taping.pdf?src-supplier=Digi-Key; ComponentLink3URL: http://rohmfs.rohm.com/en/products/databook/datasheet/discrete/transistor/mosfet/re1c002un.pdf?src-supplier=Avnet; ComponentLink3Description: http://rohmfs.rohm.com/en/products/databook/datasheet/discrete/transistor/mosfet/re1c002un.pdf?src-supplier=Avnet; ComponentLink4URL: https://www.rohm.com/datasheet/RE1C002UN/re1c002untcl-e?src-supplier=Digi-Key; ComponentLink4Description: https://www.rohm.com/datasheet/RE1C002UN/re1c002untcl-e?src-supplier=Digi-Key; ComponentLink5URL: http://www.farnell.com/datasheets/2704376.pdf?src-supplier=Newark; ComponentLink5Description: http://www.farnell.com/datasheets/2704376.pdf?src-supplier=Newark; ComponentLink6URL: http://www.farnell.com/datasheets/2704376.pdf?src-supplier=Farnell; ComponentLink6Description: http://www.farnell.com/datasheets/2704376.pdf?src-supplier=Farnell; ComponentLink7URL: http://www.farnell.com/datasheets/2704376.pdf?src-supplier=Element14; ComponentLink7Description: http://www.farnell.com/datasheets/2704376.pdf?src-supplier=Element14; Supplier 1: Digi-Key; Manufacturer Part Number 1: RE1C002UNTCL; Stock 1: 868886; Pricing 1: 1=0.20000, 10=0.18200, 100=0.09930, 500=0.06112, 1000=0.04167 (USD); Supplier Part Number 1: RE1C002UNTCLCT-ND
R25 R26 = RC0402FR-071KL: as R24 on sheet DM3390_Connector_A; RoHS: Yes; Number of Pins: 2; Case Code (Imperial): 0402; Case Code (Metric): 1005; Min Operating Temperature: -55°C; Max Operating Temperature: 155°C; Packaging: Tape and Reel; Composition: Thick Film; Voltage Rating: 50V; Military Standard: Not; Termination: SMD/SMT; Length: 1mm; Height: 0.32mm; Width: 0.5mm; Depth: 0.5mm; Lead Free: Lead Free; REACH SVHC: Unknown; ComponentLink1URL: https://datasheet.ciiva.com/11819/0900766b80c66297-11819477.pdf?src-supplier=RSComponents; ComponentLink1Description: https://datasheet.ciiva.com/11819/0900766b80c66297-11819477.pdf?src-supplier=RSComponents; ComponentLink2URL: https://datasheet.ciiva.com/12666/pyu-rc0402-51-rohs-l-6-r-12666741.pdf?src-supplier=Mouser; ComponentLink2Description: https://datasheet.ciiva.com/12666/pyu-rc0402-51-rohs-l-6-r-12666741.pdf?src-supplier=Mouser; ComponentLink3URL: https://datasheet.ciiva.com/17063/pyu-rc0402-51-rohs-l-6-r-17063193.pdf?src-supplier=Future+Electronics; ComponentLink3Description: https://datasheet.ciiva.com/17063/pyu-rc0402-51-rohs-l-6-r-17063193.pdf?src-supplier=Future+Electronics; ComponentLink4URL: https://datasheet.ciiva.com/22747/1018594-22747513.pdf?src-supplier=Element14; ComponentLink4Description: https://datasheet.ciiva.com/22747/1018594-22747513.pdf?src-supplier=Element14; ComponentLink5URL: https://datasheet.ciiva.com/7849/1018594-7849869.pdf?src-supplier=Element14; ComponentLink5Description: https://datasheet.ciiva.com/7849/1018594-7849869.pdf?src-supplier=Element14; ComponentLink6URL: https://datasheet.ciiva.com/7983/1018594-7983502.pdf?src-supplier=Element14; ComponentLink6Description: https://datasheet.ciiva.com/7983/1018594-7983502.pdf?src-supplier=Element14; ComponentLink7URL: https://datasheet.ciiva.com/7849/1018594-7849871.pdf?src-supplier=Element14; ComponentLink7Description: https://datasheet.ciiva.com/7849/1018594-7849871.pdf?src-supplier=Element14; Supplier 1: Digi-Key; Manufacturer Part Number 1: RC0402FR-071KL; Stock 1: 60695854; Pricing 1: 1=0.10000, 10=0.01600, 100=0.00670, 1000=0.00301, 2500=0.00261, 5000=0.00215 (USD); Case/Package: 0402; Tolerance: 1%; Supplier Part Number 1: 311-1.00KLRCT-ND